# Altium schematic sheet CON_CF.SchDoc: IDE Connector
size A4; SheetNumber: 1; SheetTotal: 100; Organization: Altium Limited.; Address1: Level 3, 12a Rodborough Rd; Address2: Frenchs Forest 2086; Address3: NSW; Address4: AUSTRALIA
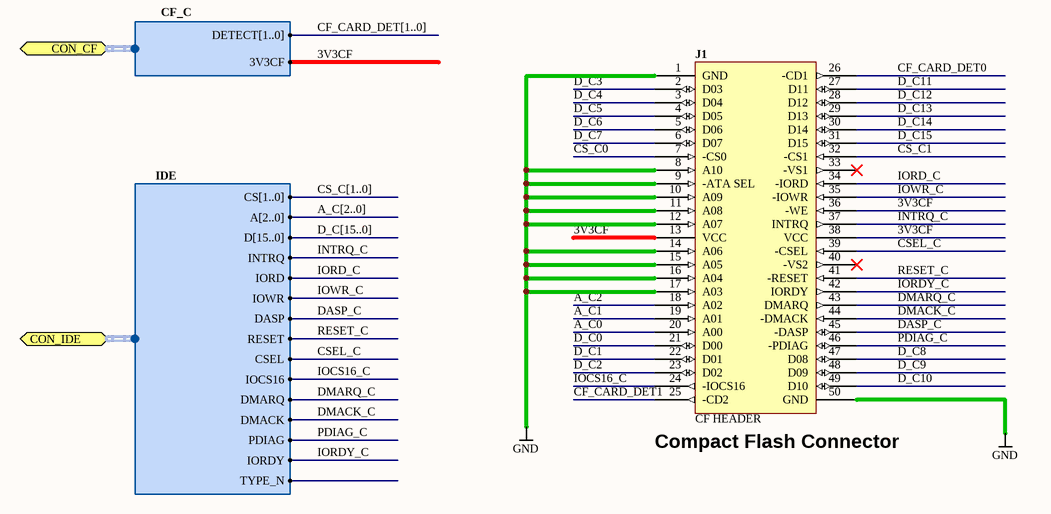
[diagram p0: CON_CF.SchDoc]

## Parts
J1  CF HEADER  [CF_SM0_635-6H50B]

## Ports
CON_CF (harness CF_C), CON_IDE (harness IDE)

## Harnesses
CF_C: DETECT[1..0], 3V3CF
IDE: CS[1..0], A[2..0], D[15..0], INTRQ, IORD, IOWR, DASP, RESET, CSEL, IOCS16, DMARQ, DMACK, PDIAG, IORDY, TYPE_N

## Nets
GND: J1.1(GND) J1.8(A10) J1.9(-ATA_SEL) J1.10(A09) J1.11(A08) J1.12(A07) J1.14(A06) J1.15(A05) J1.16(A04) J1.17(A03) J1.50(GND)
3V3CF: J1.13(VCC) J1.36(-WE) J1.38(VCC) ; port CON_CF.3V3CF
A_C0: J1.20(A00)
A_C1: J1.19(A01)
A_C2: J1.18(A02)
CF_CARD_DET0: J1.26(-CD1)
CF_CARD_DET1: J1.25(-CD2)
CS_C0: J1.7(-CS0)
CS_C1: J1.32(-CS1)
CSEL_C: J1.39(-CSEL) ; port CON_IDE.CSEL
D_C0: J1.21(D00)
D_C1: J1.22(D01)
D_C2: J1.23(D02)
D_C3: J1.2(D03)
D_C4: J1.3(D04)
D_C5: J1.4(D05)
D_C6: J1.5(D06)
D_C7: J1.6(D07)
D_C8: J1.47(D08)
D_C9: J1.48(D09)
D_C10: J1.49(D10)
D_C11: J1.27(D11)
D_C12: J1.28(D12)
D_C13: J1.29(D13)
D_C14: J1.30(D14)
D_C15: J1.31(D15)
DASP_C: J1.45(-DASP) ; port CON_IDE.DASP
DMACK_C: J1.44(-DMACK) ; port CON_IDE.DMACK
DMARQ_C: J1.43(DMARQ) ; port CON_IDE.DMARQ
INTRQ_C: J1.37(INTRQ) ; port CON_IDE.INTRQ
IOCS16_C: J1.24(-IOCS16) ; port CON_IDE.IOCS16
IORD_C: J1.34(-IORD) ; port CON_IDE.IORD
IORDY_C: J1.42(IORDY) ; port CON_IDE.IORDY
IOWR_C: J1.35(-IOWR) ; port CON_IDE.IOWR
PDIAG_C: J1.46(-PDIAG) ; port CON_IDE.PDIAG
RESET_C: J1.41(-RESET) ; port CON_IDE.RESET

Not connected (* = marked no-connect by the designer): J1 33(-VS1)* 40(-VS2)*

## Buses and harness runs
bus A_C[2..0]
bus CF_CARD_DET[1..0]
bus CS_C[1..0]
bus D_C[15..0]

## Notes on the sheet
- (near J1) Compact Flash Connector
- Title
- Size:
- Date:
- A4
- Number:
- Time:
- Revision:
- Sheet
- of
- File:

## Library data of the parts
J1 = D-300-0029: Connector, Compact Flash Card Adaptor Top-side; Max Current: mA; Category: Connector; Connector type: Header; Mounting Technology: Surface Mount; Pin Count: 50; Status: Production